# EAGLE design Puzzle - Infrared Emitter v0.9b (EAGLE 6.2)
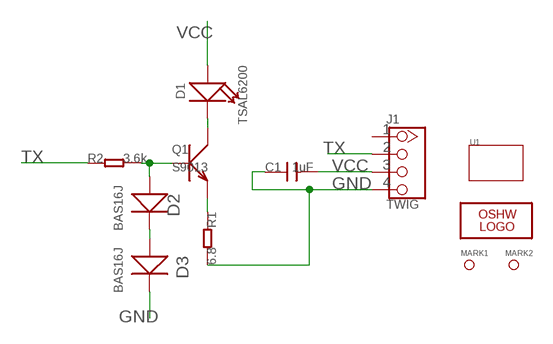
[diagram p0: schematic, sheet 1]

## Parts
C1  1uF  C-0603  [0603]
D1  TSAL6200  LED-2.54  [2P-LEADED-ROUND-2.54-R3.0]
D2  BAS16J  D-0805  [D0805]
D3  BAS16J  D-0805  [D0805]
J1  TWIG  TWIG-2.0-LEADED-2.0  [4P-LEADED-2.0]
LOGO1  LOGO-OSHW-FILLX0150-NT  [OSHW_FILLX150_NOTEXT]
MARK1  PAD-MARK  [ROUND-MARK-0.635]
MARK2  PAD-MARK  [ROUND-MARK-0.635]
Q1  S9013  TRANSISTOR-NPN-SOT23''  [SOT23]
R1  6.8  R-0805  [0805]
R2  3.6k  R-0603  [0603]
U1  TWIG-1U  [1U-DIM-W/-DRILL]

## Nets
GND: C1.1 D3.- J1.4 R1.2
N$1: D2.+ Q1.1(B) R2.2
N$2: D1.- Q1.3(C)
N$3: Q1.2(E) R1.1
N$4: D2.- D3.+
TX: J1.2 R2.1
VCC: C1.2 D1.+ J1.3
Unconnected: J1.1

## Library data of the parts
C1 = Discrete:C*: Ceramic Capacitors
D1 = Discrete:LED*
D2 D3 = Discrete:D*
J1 = Connector:TWIG-2.0-LEADED
LOGO1 = Logo:LOGO-OSHW-FILL
MARK1 MARK2 = Discrete:PAD-MARK
Q1 = Discrete:TRANSISTOR-NPN*: NPN audion
R1 R2 = Discrete:R*
U1 = Module:TWIG

## Board
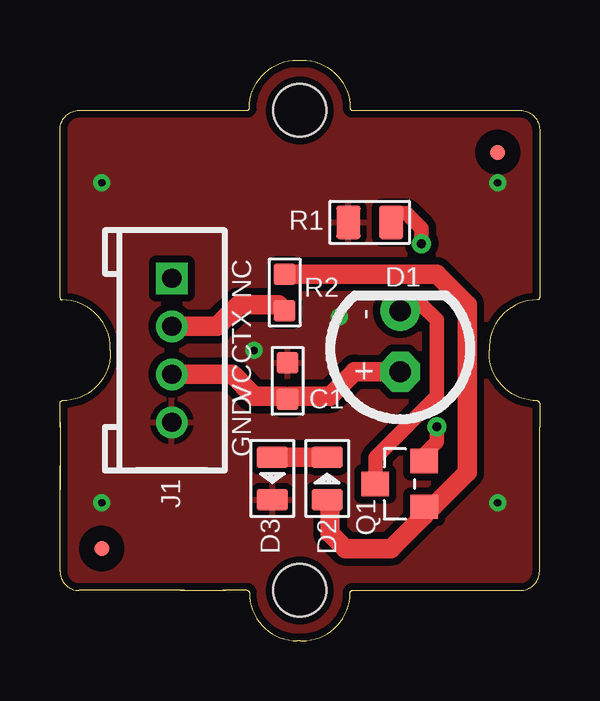
[diagram p1: board, top side]
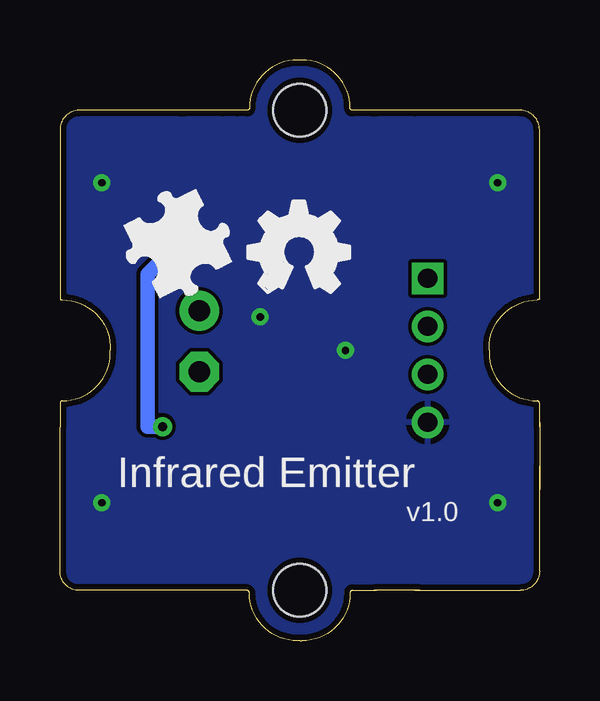
[diagram p2: board, bottom side, seen from below]

Size 20 x 24.2 mm. Coordinates in mm from the lower left corner, seen from the top.
Copper layers (1*16): Top 0.035mm / dielectric 1.5mm / Bottom 0.035mm
Design rules: minimum track width 6mil, minimum drill 12mil, track to track 6mil, track to pad 6mil, pad to pad 6mil, via to via 6mil, smd to smd 6mil, copper to edge 10mil, drill to drill 10mil, minimum pad ring 10mil, minimum via ring 8mil, stop-mask expansion 2mil, vias tented up to drill 100mil, thermal gap 10mil

### Footprints (pad centres in the part's own frame; a part is rotated, then mirrored left to right if it is on the bottom)
0603 = smd 0.889 x 0.889: 1 -0.762,0; 2 0.762,0
2P-LEADED-ROUND-2.54-R3.0 = drill 0.889 pad 1.651 octagon: + -1.27,0 | drill 0.889 pad 1.651: - 1.27,0
D0805 = smd 0.889 x 1.27: + -0.889,0; - 0.889,0
4P-LEADED-2.0 = drill 0.8 pad 1.27 square: 1 -3,0 | drill 0.8 pad 1.27: 2 -1,0; 3 1,0; 4 3,0
ROUND-MARK-0.635 = smd 0.635 x 0.635: P$1 0,0
SOT23 = smd 1.016 x 1.143: 1 -0.95,-1.016; 2 0.95,-1.016; 3 0,1.016
0805 = smd 1.016 x 1.397: 1 -0.889,0; 2 0.889,0
1U-DIM-W/-DRILL = hole 2.2: 0,-10; 0,10

### Placement (x,y rotation side)
C1  9.49,10.83 270 top
D1  14.19,12.48 90 top
D2  11.14,6.77 90 top
D3  8.86,6.77 270 top
J1  4.67,12.1 270 top
LOGO1  12.16,14.51 0 bottom
MARK1  1.74,3.84 0 top
MARK2  18.25,20.35 0 top
Q1  14.17,6.54 90 top
R1  12.92,17.43 180 top
R2  9.36,14.51 90 top
U1  10,12.1 0 top
U$2  [BRICK-LOGO-MIL-0.5]  17.62,14 0 bottom

### Tracks (layer width: path | path; a pad name or v marks a point on that pad's centre or on a via)
GND  (via drill 0.3 pad 0.64)
  other vias: 1.74,5.75 11.65,13.5 18.25,19.09 1.74,19.09 18.25,5.75 8.09,12.1
  pour Top (isolate 0.305): -0.16,-0.35 20.41,-0.35 20.41,25.05 -0.16,25.05
  pour Bottom: -0.16,-0.6 20.67,-0.6 20.67,25.31 -0.16,25.31
N$1
  Top 0.406: 15.18,5.22 Q1.1 15.55,5.59
  Top 0.813: 15.18,5.22 13.81,3.84 11.91,3.84 11.27,4.48 11.27,5.75 D2.+ | R2.2 15.71,15.27 16.98,14 16.98,7.02 15.55,5.59
N$2
  Top 0.61: Q1.3 13.15,7.63 15.71,10.2 15.71,13.37 15.08,14 14.44,14 D1.-
N$3  (via drill 0.38)
  Top 0.406: Q1.2 15.18,7.76 | 13.81,17.81 R1.1
  Top 0.61: 15.18,7.76 15.71,8.29 v15.71,8.92 | v15.08,16.54 15.08,17.18 14.44,17.81 13.81,17.81
  Bottom 0.61: v15.08,16.54 16.35,15.27 16.35,8.92 v15.71,8.92
N$4
  Top 0.813: D2.- D3.+
TX
  Top 0.406: 9.11,14 R2.1
  Top 0.813: J1.2 6.55,13.1 7.46,14 9.11,14
VCC
  Top 0.406: 9.62,10.2 C1.2 9.36,10.2
  Top 0.813: D1.+ 12.29,11.21 11.27,10.2 9.62,10.2 | J1.3 7.19,11.1 8.09,10.2 9.36,10.2

### Text on the board
tPlace: NC | TX | VCC | GND
bPlace: Infrared Emitter | v1.0